# Altium project Arduino_3D_Extension.PrjPcb
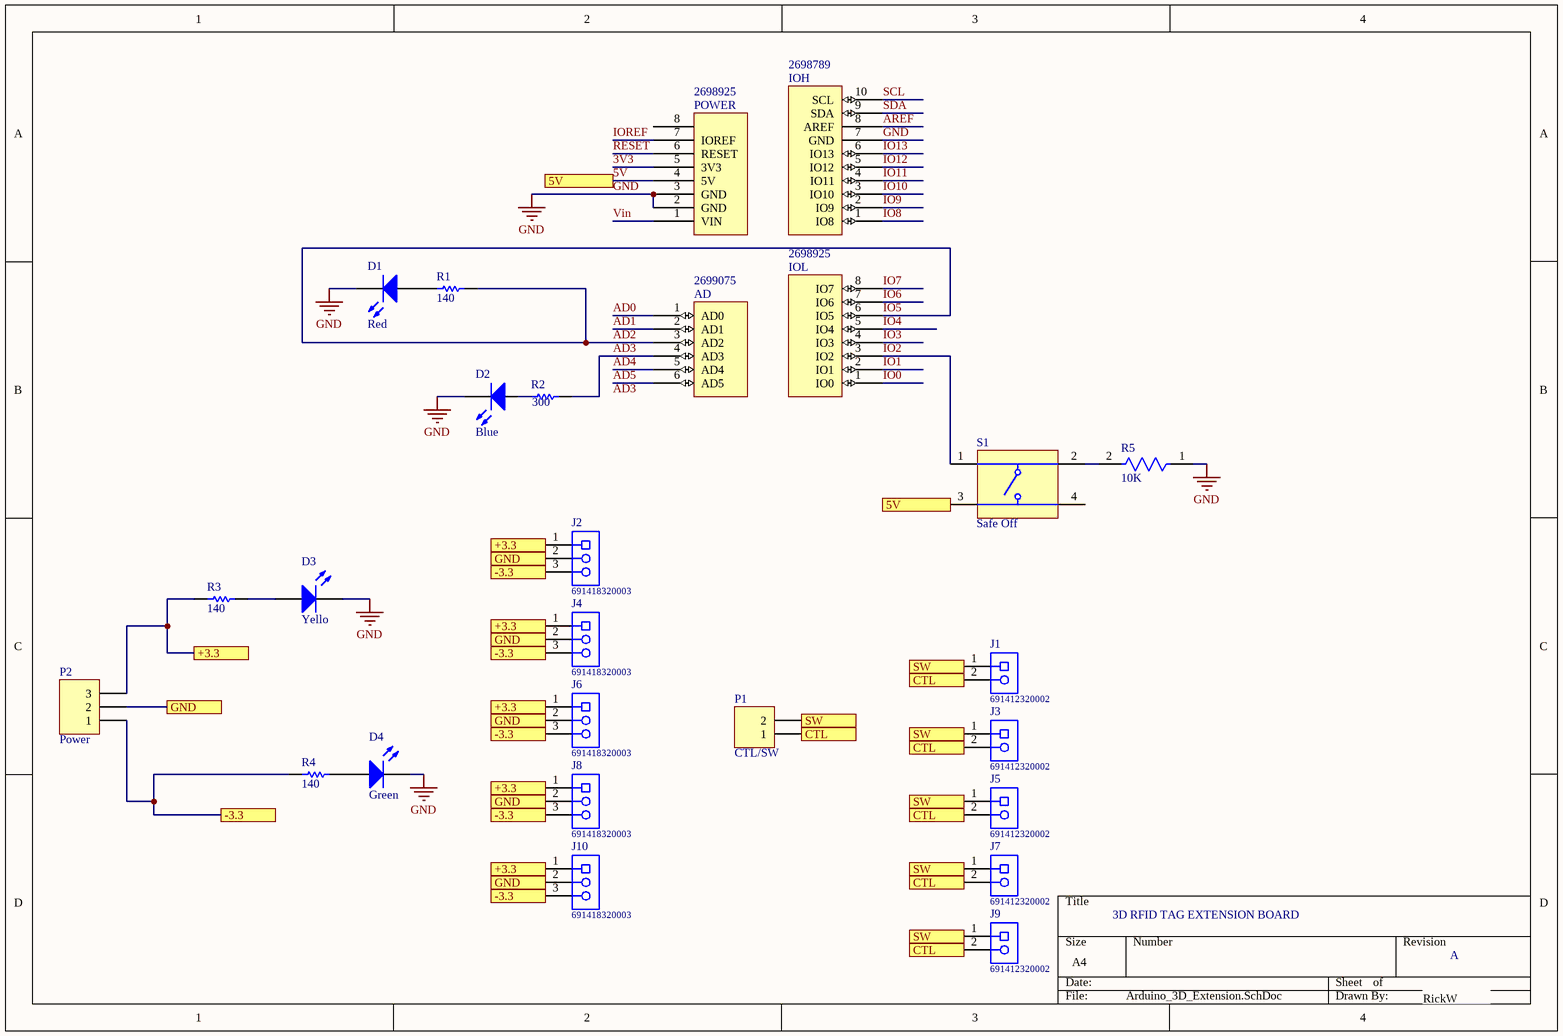
[diagram p0: Arduino_3D_Extension.SchDoc]
1 sheet, 26 parts. Net scope: flat (ports and power ports of the same name join across sheets).
Board file: Arduino_3D_Extension..PcbDoc

## Sheet Arduino_3D_Extension.SchDoc
size A4

### Parts
AD  Supplier Part Number 4: 2699075  [Header 6x1 8.5mm]  (hidden comment: AD)
D1  Red  [0805_A]
D2  Blue  [0805_A]
D3  Yello  [0805_A]
D4  Green  [0805_A]
IOH  Supplier Part Number 3: 2698789  [Header 10x1 8.5mm]  (hidden comment: IOH)
IOL  Supplier Part Number 4: 2698925  [Header 8x1 8.5mm]  (hidden comment: IOL)
J1  691412320002  [691412320002]
J2  691418320003  [691418320003]
J3  691412320002  [691412320002]
J4  691418320003  [691418320003]
J5  691412320002  [691412320002]
J6  691418320003  [691418320003]
J7  691412320002  [691412320002]
J8  691418320003  [691418320003]
J9  691412320002  [691412320002]
J10  691418320003  [691418320003]
P1  CTL/SW  [HDR1X2]
P2  Power  [HDR1X3]
POWER  Supplier Part Number 4: 2698925  [Header 8x1 8.5mm]  (hidden comment: POWER_UNO)
R1  140  [RESC1608X55X30ML15T15]
R2  300  [RESC1608X55X30ML15T15]
R3  140  [RESC1608X55X30ML15T15]
R4  140  [RESC1608X55X30ML15T15]
R5  10K  [FP-RNCP0603-MFG]
S1  Safe Off  [TECO-FSM4JSMA_V]

### Ports
5V, +3.3, -3.3, CTL, GND, SW

### Nets
GND: D1.1(K) D2.1(K) D3.1(K) D4.1(K) IOH.7(GND) POWER.2(GND) POWER.3(GND) R5.1
3V3: POWER.5(3V3)
5V: POWER.4(5V) S1.3 ; port 5V
AD0: AD.1(AD0)
AD1: AD.2(AD1)
AD2: AD.3(AD2) IOL.6(IO5) R1.1  [also labelled IO5]
AD3: AD.4(AD3) R2.2
AD4: AD.5(AD4)
AD5: AD.6(AD5)
AREF: IOH.8(AREF)
IO0: IOL.1(IO0)
IO1: IOL.2(IO1)
IO2: IOL.3(IO2) S1.1
IO3: IOL.4(IO3)
IO4: IOL.5(IO4)
IO6: IOL.7(IO6)
IO7: IOL.8(IO7)
IO8: IOH.1(IO8)
IO9: IOH.2(IO9)
IO10: IOH.3(IO10)
IO11: IOH.4(IO11)
IO12: IOH.5(IO12)
IO13: IOH.6(IO13)
IOREF: POWER.7(IOREF)
RESET: POWER.6(RESET)
SCL: IOH.10(SCL)
SDA: IOH.9(SDA)
Vin: POWER.1(VIN)
NetD1_2: D1.2(A) R1.2
NetD2_2: D2.2(A) R2.1
NetD3_2: D3.2(A) R3.2
NetD4_2: D4.2(A) R4.2
NetJ1_1: J1.1 J3.1 J5.1 J7.1 J9.1 P1.2 ; port SW
NetJ1_2: J1.2 J3.2 J5.2 J7.2 J9.2 P1.1 ; port CTL
NetJ2_1: J2.1 J4.1 J6.1 J8.1 J10.1 P2.3 R3.1 ; port +3.3
NetJ2_2: J2.2 J4.2 J6.2 J8.2 J10.2 P2.2 ; port GND
NetJ2_3: J2.3 J4.3 J6.3 J8.3 J10.3 P2.1 R4.1 ; port -3.3
NetR5_2: R5.2 S1.2

Not connected (* = marked no-connect by the designer): POWER 8; S1 4

### Notes on the sheet
- 3D RFID TAG EXTENSION BOARD
- A
- RickW
- Labels drawn without touching a wire or pin: AD3

### Library data of the parts
D1 D3 D4 = CMP-1426-00011-1: SMD mono-color Chip LED, WL-SMCW, Red; PartNumber: 150080RS75000; Manufacturer: Wuerth Elektronik; Color: Red; PackageReference: 0805_A; ComponentLink2Description: Datasheet; ComponentLink1URL: http://www.we-online.com; ComponentLink1Description: Manufacturer URL; ComponentLink2URL: http://katalog.we-online.com/led/datasheet/150080RS75000.pdf
D2 = CMP-1426-00008-1: SMD mono-color Chip LED, WL-SMCW, Blue; Manufacturer: Wuerth Elektronik; PartNumber: 150080BS75000; Color: Blue; ComponentLink2URL: http://katalog.we-online.com/led/datasheet/150080BS75000.pdf; ComponentLink1URL: http://www.we-online.com; ComponentLink2Description: Datasheet; PackageReference: 0805_A; ComponentLink1Description: Manufacturer URL
J1 J3 J5 J7 J9 = CMP-1502-02948-1: Serie 4123 - 3.81mm Screwless 45deg Entry WR-TBL, 2 pin; Manufacturer: Wurth Elektronik; Pin Number: 2; Mounting Technology: THT; Pitch: 3.81mm; Publisher: WurthElektronik; Packaging: Box; Part Number: 691412320002; Package Reference: 691412320002; Operating Temperature: -30to120degC; Datasheet URL: http://katalog.we-online.de/em/datasheet/691412320002.pdf; Manufacturer URL: http://www.we-online.de
J2 J4 J6 J8 J10 = CMP-1502-02976-1: Serie 4183 - 3.81mm 45deg Entry Screwless WR-TBL, 3 pin; Manufacturer: Wurth Elektronik; Pin Number: 3; Datasheet URL: http://katalog.we-online.de/em/datasheet/6914183200xx.pdf; Publisher: WurthElektronik; Pitch: 3.81mm; Manufacturer URL: http://www.we-online.de; Part Number: 691418320003; Operating Temperature: -30to120degC; Mounting Technology: THT; Package Reference: 691418320003; Packaging: Box
P1 = Header 2: Header, 2-Pin; LatestRevisionDate: 17-Jul-2002; LatestRevisionNote: Re-released for DXP Platform.; Publisher: Altium Limited
P2 = Header 3: Header, 3-Pin; LatestRevisionDate: 17-Jul-2002; LatestRevisionNote: Re-released for DXP Platform.; Publisher: Altium Limited
R1 R3 R4 = CMP-2000-00245-1: Part Number: ERJ-3EKF1400V; Manufacturer: Panasonic
R2 = CMP-2000-00766-1: Manufacturer: Panasonic; Part Number: ERJ-3GEYJ301V
R5 = CMP-26527-000099-1: 10kΩ ±1% 0.125W 0603 High Power Anti-Sulfur Thin Film Chip Resistor; Resistance: 10kR; Max Power Dissipation: 125mW; Temperature Coefficient: 100ppm/°C; Max Operating Temperature: 155°C; Width: 0.031inch; Height: 0.02inch; Lead Free: Lead Free; Contact Plating: Tin; Tolerance: 1%; Resistor Type: Thin Film; Series: RNCP; RoHS Compliant: Yes; Features: Moisture Resistant; Min Operating Temperature: -55°C; Case Code (Metric): 1608; Case/Package: 0603; Mount: Surface Mount; Packaging: Tape and Reel; Radiation Hardening: No; Length: 0.059inch; Number of Terminations: 2; Case Code (Imperial): 0603
S1 = CMP-2000-05602-2: Swicth, SPST, 24 V, -35 to 85 degC, 4-Pin SMD, RoHS, Tape and Reel; Manufacturer: TE Connectivity; Switch Travel: 0.25mm; Mechanical Life: 100000Cycles; Contact Current Rating: 50mA; Operating Force: 1.57N; Actuator Material: Polyamide; Contact Resistance: 100mOhm; Voltage Rating: 24V; Illumination Type: Illuminated; Actuator Length: 0.055inch; Max Voltage Rating (DC): 12V; Case\/Package: SMD/SMT; Orientation: Straight; Datasheet URL: http://www.te.com/commerce/DocumentDelivery/DDEController?Action=showdoc&DocId=Customer+Drawing%7F2-1437565-7%7FV%7Fpdf%7FEnglish%7FENG_CD_2-1437565-7_V.pdf%7F4-1437565-2; Min Operating Temperature: -35degC; Packaging: LoosePiece; Termination: GullWing; Throw Configuration: SPST; Package Description: 4-Pin Surface Mount Device, Body 6 x 6 mm, Pitch 4.5 mm; Mounting Technology: SurfaceMount; Contact Plating: Silver; Datasheet Version: Rev. V, 02/2015; RoHSCompliant: true; Max Operating Temperature: 85degC; Length: 6mm; Voltage Rating (DC): 24V; Electrical Life: 100000Cycles; Current Rating: 50mA; Package Quantity: 750; Mount: SurfaceMount; Package Reference: FSM4JSMA; Manufacturer URL: http://www.te.com/; Width: 6mm; REACH SVHC: Unknown; Contact Material: CopperAlloy
AD = AD: Supplier 1: Arrow; Supplier Part Number 1: 2699089; Supplier 2: Digi-Key; Supplier Part Number 2: SAM1198-06-ND; Supplier 3: Arrow; Supplier Part Number 3: 2699088; Supplier 4: Arrow
IOH = IOH: Supplier 1: Arrow; Supplier Part Number 1: 2698803S4475693N1004; Supplier 2: Digi-Key; Supplier Part Number 2: SAM1198-10-ND; Supplier 3: Arrow
IOL = IOL: Supplier 1: Digi-Key; Supplier Part Number 1: SAM1198-08-ND; Supplier 2: Arrow; Supplier Part Number 2: 2698939; Supplier 3: Arrow; Supplier Part Number 3: 2698940; Supplier 4: Arrow
POWER = POWER_UNO: Supplier 1: Digi-Key; Supplier Part Number 1: SAM1198-08-ND; Supplier 2: Arrow; Supplier Part Number 2: 2698939; Supplier 3: Arrow; Supplier Part Number 3: 2698940; Supplier 4: Arrow